# Altium schematic sheet Sheet2.SchDoc
size A4; SheetNumber: 1; SheetTotal: 1
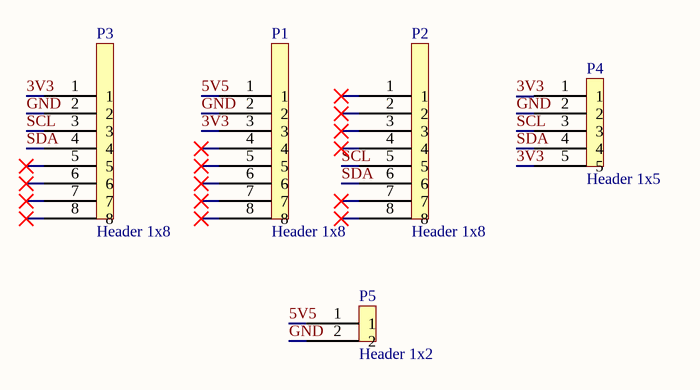
[diagram p0: Sheet2.SchDoc]

## Parts
P1  Header 1x8  [HDR1x8 2.54mm]
P2  Header 1x8  [HDR1x8 2.54mm]
P3  Header 1x8  [HDR1x8 2.54mm]
P4  Header 1x5  [HDR1x5 2.54mm]
P5  Header 1x2  [HDR1x2 2.54MM]

## Nets
3V3: P1.3 P3.1 P4.1 P4.5
5V5: P1.1 P5.1
GND: P1.2 P3.2 P4.2 P5.2
SCL: P2.5 P3.3 P4.3
SDA: P2.6 P3.4 P4.4

Not connected (* = marked no-connect by the designer): P1 4* 5* 6* 7* 8*; P2 1* 2* 3* 4* 7* 8*; P3 5* 6* 7* 8*